# EAGLE design W101A (EAGLE 6.6.0)
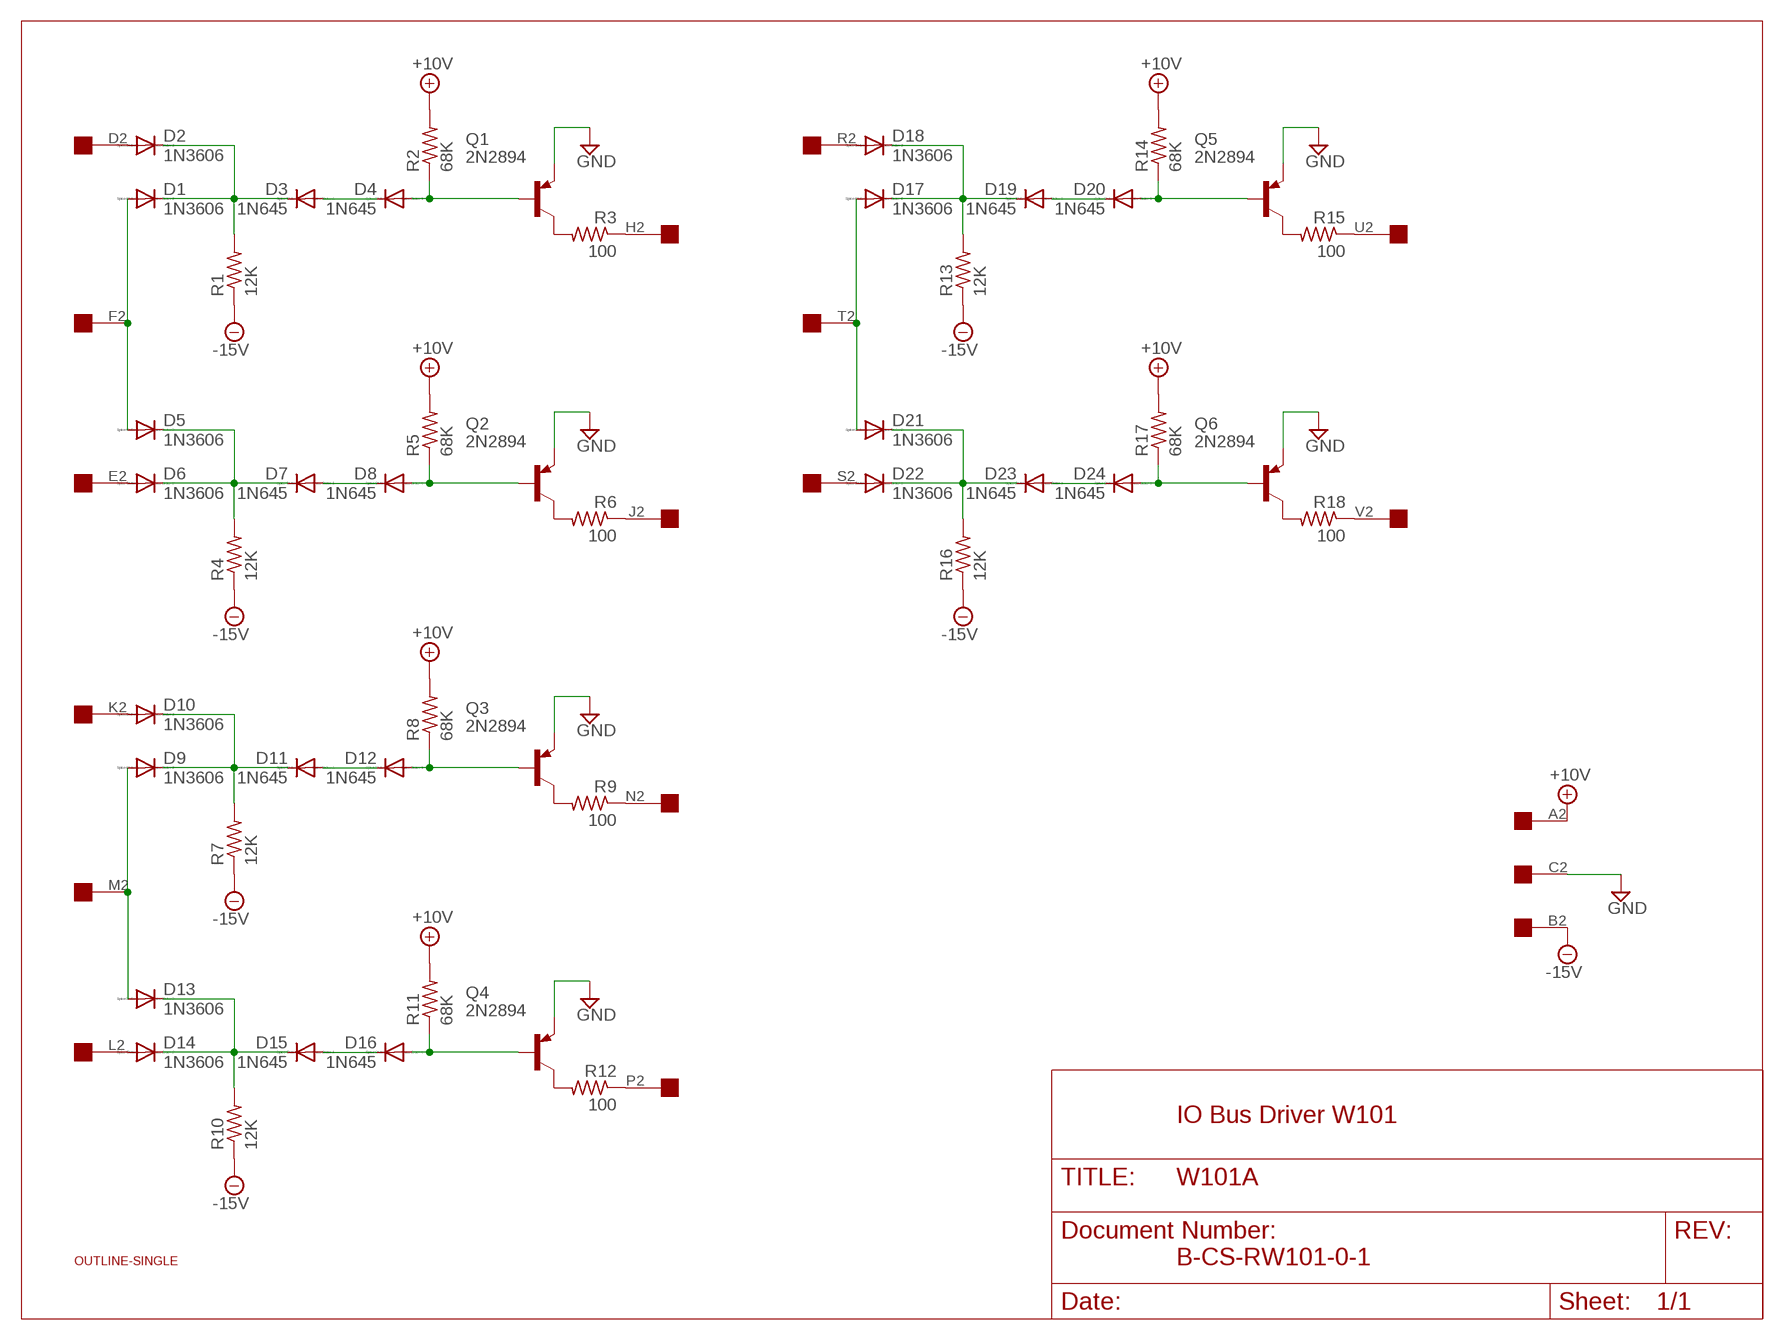
[diagram p0: schematic, sheet 1]

## Parts
D1  1N3606  1N4148DO35-10  [DO35-10]
D2  1N3606  1N4148DO35-10  [DO35-10]
D3  1N645  1N4148DO35-10  [DO35-10]
D4  1N645  1N4148DO35-10  [DO35-10]
D5  1N3606  1N4148DO35-10  [DO35-10]
D6  1N3606  1N4148DO35-10  [DO35-10]
D7  1N645  1N4148DO35-10  [DO35-10]
D8  1N645  1N4148DO35-10  [DO35-10]
D9  1N3606  1N4148DO35-10  [DO35-10]
D10  1N3606  1N4148DO35-10  [DO35-10]
D11  1N645  1N4148DO35-10  [DO35-10]
D12  1N645  1N4148DO35-10  [DO35-10]
D13  1N3606  1N4148DO35-10  [DO35-10]
D14  1N3606  1N4148DO35-10  [DO35-10]
D15  1N645  1N4148DO35-10  [DO35-10]
D16  1N645  1N4148DO35-10  [DO35-10]
D17  1N3606  1N4148DO35-10  [DO35-10]
D18  1N3606  1N4148DO35-10  [DO35-10]
D19  1N645  1N4148DO35-10  [DO35-10]
D20  1N645  1N4148DO35-10  [DO35-10]
D21  1N3606  1N4148DO35-10  [DO35-10]
D22  1N3606  1N4148DO35-10  [DO35-10]
D23  1N645  1N4148DO35-10  [DO35-10]
D24  1N645  1N4148DO35-10  [DO35-10]
Q1  2N2894  2N3637  [TO39]
Q2  2N2894  2N3637  [TO39]
Q3  2N2894  2N3637  [TO39]
Q4  2N2894  2N3637  [TO39]
Q5  2N2894  2N3637  [TO39]
Q6  2N2894  2N3637  [TO39]
R1  12K  R-US_0207/10  [0207/10]
R2  68K  R-US_0207/10  [0207/10]
R3  100  R-US_0207/10  [0207/10]
R4  12K  R-US_0207/10  [0207/10]
R5  68K  R-US_0207/10  [0207/10]
R6  100  R-US_0207/10  [0207/10]
R7  12K  R-US_0207/10  [0207/10]
R8  68K  R-US_0207/10  [0207/10]
R9  100  R-US_0207/10  [0207/10]
R10  12K  R-US_0207/10  [0207/10]
R11  68K  R-US_0207/10  [0207/10]
R12  100  R-US_0207/10  [0207/10]
R13  12K  R-US_0207/10  [0207/10]
R14  68K  R-US_0207/10  [0207/10]
R15  100  R-US_0207/10  [0207/10]
R16  12K  R-US_0207/10  [0207/10]
R17  68K  R-US_0207/10  [0207/10]
R18  100  R-US_0207/10  [0207/10]
U$1  OUTLINE-SINGLE  [SINGLE]
U$2  EDGE-1  [EDGE-CON1]

## Nets
+10V [Power]: R2.2 R5.2 R8.2 R11.2 R14.2 R17.2 U$2.A2
-15V [Power]: R1.1 R4.1 R7.1 R10.1 R13.1 R16.1 U$2.B2
GND [Power]: Q1.1(E) Q2.1(E) Q3.1(E) Q4.1(E) Q5.1(E) Q6.1(E) U$2.C2
N$1: D2.A U$2.D2
N$2: D8.A Q2.2(B) R5.1
N$3: R3.1 U$2.H2
N$4: Q2.3(C) R6.2
N$5: D6.A U$2.E2
N$6: D5.C D6.C D7.C R4.2
N$7: D7.A D8.C
N$8: D12.A Q3.2(B) R8.1
N$9: Q3.3(C) R9.2
N$10: D9.A D13.A U$2.M2
N$11: D9.C D10.C D11.C R7.2
N$12: D11.A D12.C
N$13: R6.1 U$2.J2
N$14: D10.A U$2.K2
N$15: R9.1 U$2.N2
N$16: R12.1 U$2.P2
N$17: D18.A U$2.R2
N$18: R15.1 U$2.U2
N$19: D4.A Q1.2(B) R2.1
N$20: Q1.3(C) R3.2
N$21: D1.A D5.A U$2.F2
N$22: D1.C D2.C D3.C R1.2
N$23: D3.A D4.C
N$24: D16.A Q4.2(B) R11.1
N$25: Q4.3(C) R12.2
N$26: D14.A U$2.L2
N$27: D13.C D14.C D15.C R10.2
N$28: D15.A D16.C
N$29: D20.A Q5.2(B) R14.1
N$30: Q5.3(C) R15.2
N$31: D17.A D21.A U$2.T2
N$32: D17.C D18.C D19.C R13.2
N$33: D19.A D20.C
N$34: D24.A Q6.2(B) R17.1
N$35: Q6.3(C) R18.2
N$36: D22.A U$2.S2
N$37: D21.C D22.C D23.C R16.2
N$38: D23.A D24.C
N$39: R18.1 U$2.V2

## Notes on the sheet
- IO Bus Driver W101
- B-CS-RW101-0-1

## Library data of the parts
D1-D24 = diode:1N4148: DIODE high speed (Philips)
Q1-Q6 = transistor-pnp:2N3637*: PNP Transistror
R1-R18 = rcl:R-US_: RESISTOR, American symbol
U$1 = dec-con:OUTLINE-*: Board outlines for DEC boards.
U$2 = dec-con:EDGE-1: Single-Sided DEC Edge Connector -- (side 2)

## Net classes
1 Power: width 0.813 mm

## Board
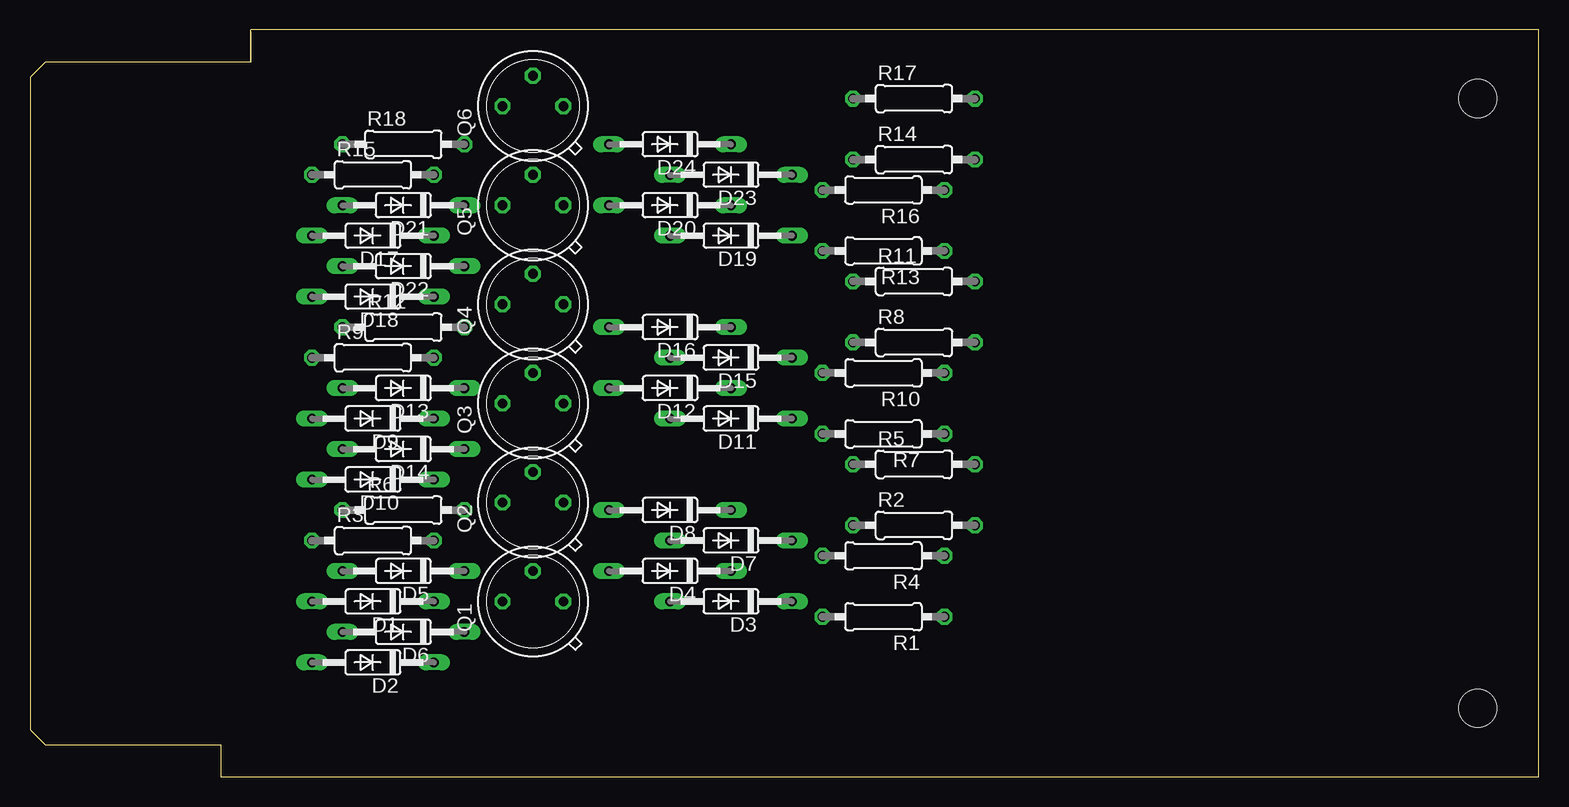
[diagram p1: board, top side]
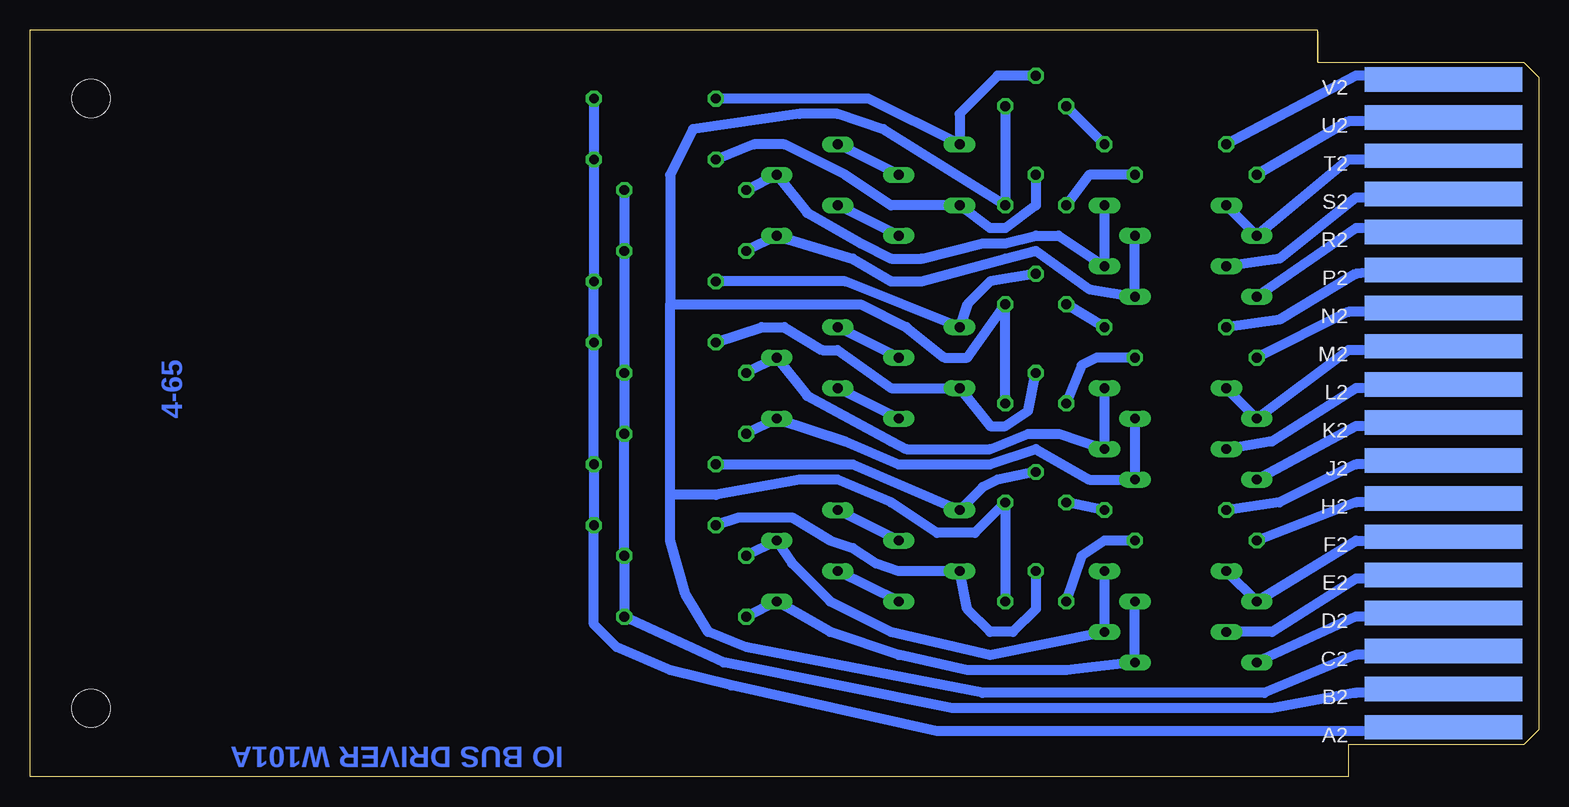
[diagram p2: board, bottom side, seen from below]

Size 125.73 x 62.23 mm. Coordinates in mm from the lower left corner, seen from the top.
Copper layers (1+16): Top 0.035mm / dielectric 1.5mm / Bottom 0.035mm
Design rules "16mils": minimum track width 16mil, minimum drill 32mil, track to track 15mil, track to pad 10mil, pad to pad 10mil, via to via 10mil, smd to smd 10mil, copper to edge 13mil, drill to drill 10mil, minimum pad ring 10mil, minimum via ring 8mil, stop-mask expansion 0mil, vias tented up to drill 0mil, thermal gap 10mil

### Footprints (pad centres in the part's own frame; a part is rotated, then mirrored left to right if it is on the bottom)
DO35-10 = drill 0.813 long: A 5.08,0; C -5.08,0
TO39 = drill 0.813 octagon: 1 0,-2.54; 2 2.54,0; 3 0,2.54
0207/10 = drill 0.813 octagon: 1 -5.08,0; 2 5.08,0
SINGLE = hole 3.175: 120.65,56.515; 120.65,5.715
EDGE-CON1 = smd 13.106 x 2.032 bottom: A2 7.938,4.128; B2 7.938,7.303; C2 7.938,10.477; D2 7.938,13.652; E2 7.938,16.828; F2 7.938,20.003; H2 7.938,23.177; J2 7.938,26.352; K2 7.938,29.527; L2 7.938,32.703; M2 7.938,35.877; N2 7.938,39.053; P2 7.938,42.227; R2 7.938,45.403; S2 7.938,48.578; T2 7.938,51.752; U2 7.938,54.928; V2 7.938,58.102

### Placement (x,y rotation side)
D1  28.58,14.61 180 top
D2  28.58,9.53 180 top
D3  58.42,14.61 180 top
D4  53.34,17.14 180 top
D5  31.12,17.14 180 top
D6  31.12,12.06 180 top
D7  58.42,19.68 180 top
D8  53.34,22.23 180 top
D9  28.58,29.84 180 top
D10  28.58,24.77 180 top
D11  58.42,29.84 180 top
D12  53.34,32.38 180 top
D13  31.12,32.38 180 top
D14  31.12,27.3 180 top
D15  58.42,34.92 180 top
D16  53.34,37.47 180 top
D17  28.58,45.09 180 top
D18  28.58,40.01 180 top
D19  58.42,45.09 180 top
D20  53.34,47.62 180 top
D21  31.12,47.62 180 top
D22  31.12,42.55 180 top
D23  58.42,50.16 180 top
D24  53.34,52.7 180 top
Q1  41.91,14.61 90 top
Q2  41.91,22.86 90 top
Q3  41.91,31.11 90 top
Q4  41.91,39.37 90 top
Q5  41.91,47.62 90 top
Q6  41.91,55.88 90 top
R1  71.12,13.34 180 top
R2  73.66,20.95 0 top
R3  28.58,19.68 0 top
R4  71.12,18.41 180 top
R5  73.66,26.04 0 top
R6  31.12,22.23 0 top
R7  71.12,28.57 180 top
R8  73.66,36.2 0 top
R9  28.58,34.92 0 top
R10  71.12,33.66 180 top
R11  73.66,41.27 0 top
R12  31.12,37.47 0 top
R13  71.12,43.81 180 top
R14  73.66,51.44 0 top
R15  28.58,50.16 0 top
R16  71.12,48.9 180 top
R17  73.66,56.52 0 top
R18  31.12,52.7 0 top
U$1  0,0 0 top
U$2  0,0 0 top

### Tracks (layer width: path | path; a pad name or v marks a point on that pad's centre or on a via)
+10V
  Bottom 0.813: R17.2 R14.2 R11.2 R8.2 R5.2 R2.2 78.74,12.7 76.84,10.79 72.39,8.89 67.31,7.62 50.17,3.81 8.89,3.81 U$2.A2
-15V
  Bottom 0.813: U$2.B2 9.53,6.99 15.24,6.99 22.23,5.71 48.9,5.71 67.95,9.53 R1.1 R4.1 R7.1 R10.1 R13.1 R16.1
GND
  Bottom 0.813: U$2.C2 9.53,10.16 15.24,10.16 22.86,6.99 46.36,6.99 66.04,10.79 69.22,12.06 71.12,15.24 72.39,19.68 72.39,23.5 | Q1.1 Q2.1 46.99,20.32 50.17,20.32 53.98,22.86 58.42,24.77 61.6,24.77 68.58,23.5 72.39,23.5 | Q6.1 Q5.1 54.61,53.98 58.42,55.24 61.6,55.24 70.49,53.98 72.39,50.16 72.39,39.37 | 72.39,39.37 56.52,39.37 52.71,37.47 49.53,34.92 47.63,34.92 Q4.1 Q3.1 | 72.39,23.5 72.39,39.37
N$1
  Bottom 0.813: U$2.D2 9.53,13.34 15.24,13.34 D2.A
N$2
  Bottom 0.813: R5.1 57.15,26.04 D8.A 46.36,24.13 45.09,24.77 Q2.2
N$3
  Bottom 0.813: U$2.H2 8.89,22.86 15.24,22.86 R3.1
N$4
  Bottom 0.813: R6.2 Q2.3
N$5
  Bottom 0.813: U$2.E2 8.89,16.51 15.24,16.51 22.23,12.06 D6.A
N$6
  Bottom 0.813: R4.2 D7.C 62.23,17.78 59.06,14.61 53.98,12.06 45.72,10.16 D6.C D5.C
N$7
  Bottom 0.813: D7.A D8.C
N$8
  Bottom 0.813: R8.1 64.77,37.47 62.87,37.47 59.69,35.56 58.42,35.56 53.98,32.38 D12.A 45.72,29.21 44.45,29.21 42.55,30.48 Q3.2
N$9
  Bottom 0.813: R9.2 36.83,34.92 38.1,34.29 Q3.3
N$10
  Bottom 0.813: U$2.M2 8.89,35.56 15.88,35.56 D9.A D13.A
N$11
  Bottom 0.813: D9.C D10.C 37.47,24.77 41.91,27.3 45.72,26.04 53.34,26.04 57.79,27.94 D11.C R7.2
N$12
  Bottom 0.813: D11.A D12.C
N$13
  Bottom 0.813: U$2.J2 9.53,26.04 15.24,26.04 21.59,22.86 R6.1
N$14
  Bottom 0.813: U$2.K2 9.53,29.21 15.24,29.21 D10.A
N$15
  Bottom 0.813: U$2.N2 10.16,38.73 15.88,38.73 R9.1
N$16
  Bottom 0.813: U$2.P2 8.26,42.55 15.24,41.91 21.59,38.1 R12.1
N$17
  Bottom 0.813: U$2.R2 8.89,45.72 15.24,45.72 D18.A
N$18
  Bottom 0.813: U$2.U2 8.89,54.61 15.88,54.61 R15.1
N$19
  Bottom 0.813: Q1.2 41.91,13.97 43.82,12.06 45.72,12.06 47.63,13.97 D4.A 53.34,17.14 55.25,17.78 57.15,19.05 59.06,19.68 62.23,21.59 66.68,21.59 R2.1
N$20
  Bottom 0.813: R3.2 36.2,19.68 38.1,18.41 Q1.3
N$21
  Bottom 0.813: D5.A D1.A 15.24,19.68 8.89,19.68 U$2.F2
N$22
  Bottom 0.813: R1.2 D3.C 59.06,12.06 53.34,10.16 47.63,8.89 39.37,8.89 D2.C D1.C
N$23
  Bottom 0.813: D3.A D4.C
N$24
  Bottom 0.813: Q4.2 45.72,41.27 47.63,39.37 D16.A 57.79,41.27 R11.1
N$25
  Bottom 0.813: R12.2 Q4.3
N$26
  Bottom 0.813: U$2.L2 8.89,32.38 15.24,32.38 22.23,27.94 D14.A
N$27
  Bottom 0.813: D13.C D14.C 40.01,28.57 42.55,28.57 45.72,27.3 52.71,27.3 53.98,27.94 60.96,31.75 D15.C R10.2
N$28
  Bottom 0.813: D15.A D16.C
N$29
  Bottom 0.813: Q5.2 41.91,47.62 44.45,45.72 45.72,45.72 D20.A 53.98,47.62 57.79,50.16 62.87,52.7 65.41,52.7 R14.1
N$30
  Bottom 0.813: R15.2 37.47,50.16 Q5.3
N$31
  Bottom 0.813: U$2.T2 8.26,51.44 15.88,51.44 D17.A D21.A
N$32
  Bottom 0.813: D17.C D18.C 37.47,40.64 41.91,43.81 44.45,43.18 51.44,41.27 53.98,41.27 57.15,43.18 D19.C R13.2
N$33
  Bottom 0.813: D19.A D20.C
N$34
  Bottom 0.813: Q6.2 45.09,58.42 48.26,55.24 D24.A 55.88,56.52 R17.1
N$35
  Bottom 0.813: R18.2 Q6.3
N$36
  Bottom 0.813: U$2.S2 8.26,48.26 15.24,48.26 21.59,43.18 D22.A
N$37
  Bottom 0.813: D21.C D22.C 40.01,45.09 41.91,45.09 44.45,44.45 46.36,44.45 51.44,43.18 53.98,43.18 56.52,44.45 60.96,46.99 D23.C R16.2
N$38
  Bottom 0.813: D23.A D24.C
N$39
  Bottom 0.813: U$2.V2 8.26,58.42 15.24,58.42 R18.1

### Text on the board
Bottom: 4-65 | IO BUS DRIVER W101A
Document: Use W101A Etch